# EAGLE design tweeq-STAMP_I2C_PRESSURE BMP180 v1 (EAGLE 7.2.0)
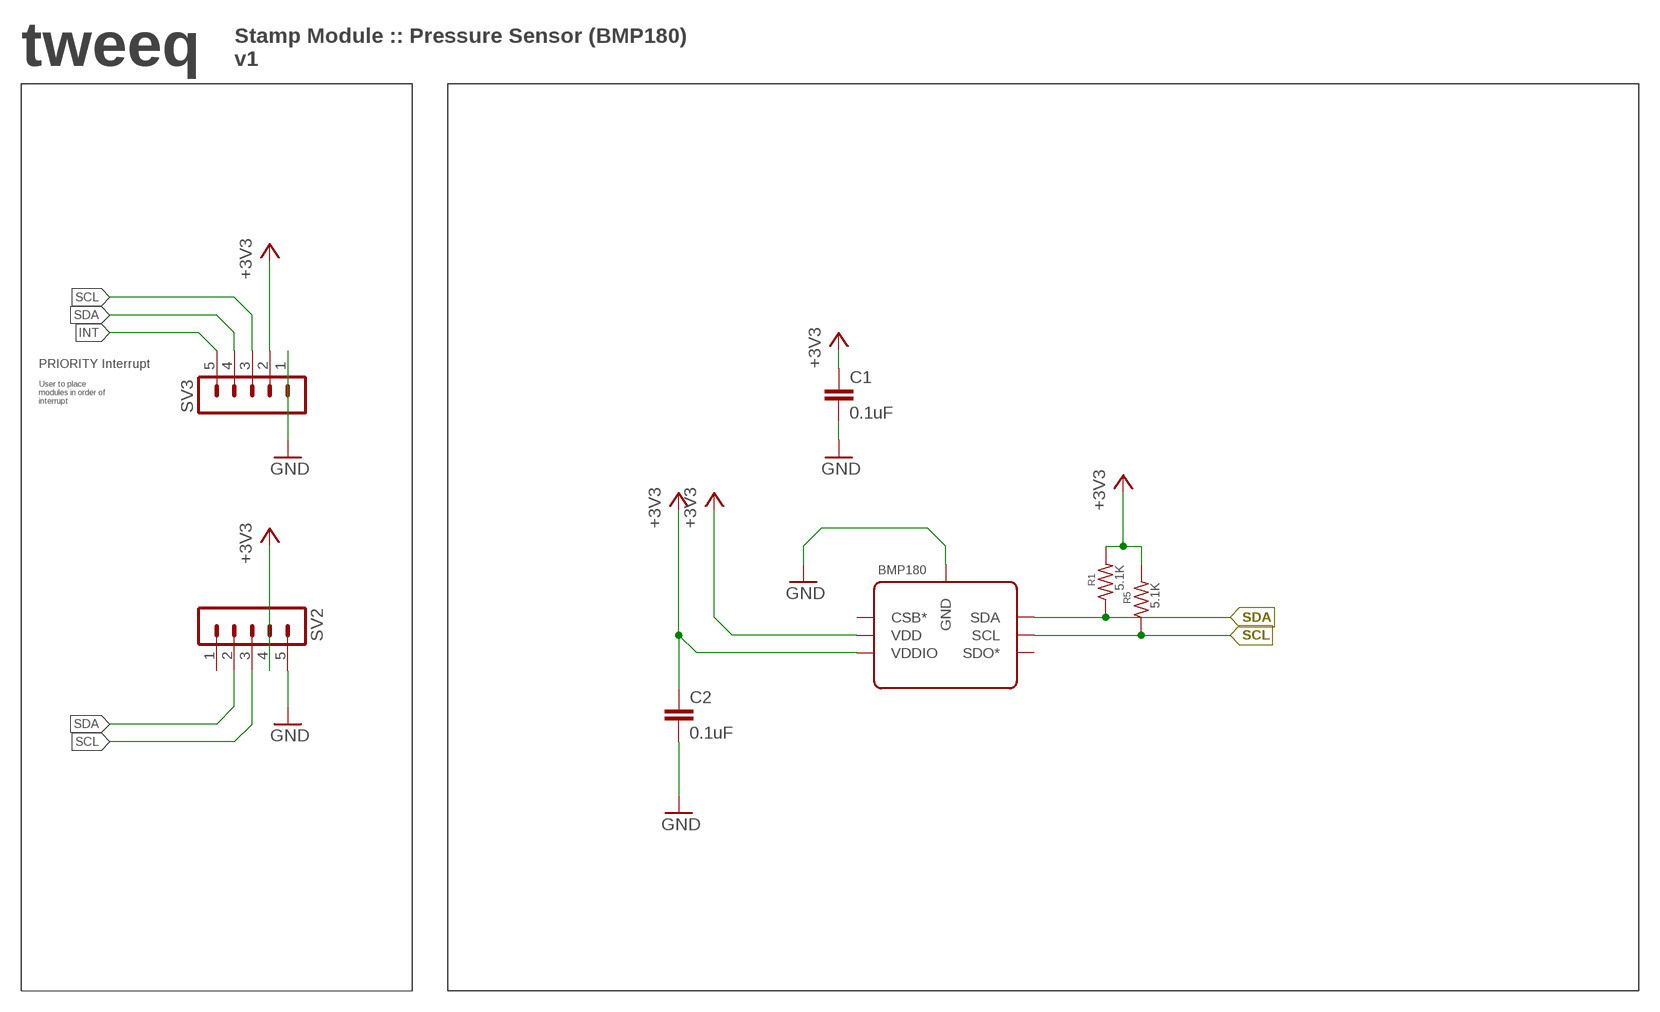
[diagram p0: schematic, sheet 1]

## Parts
BMP180  BMP180  [LGA-7PIN]
C1  0.1uF  C-EUC0402K  [C0402K]
C2  0.1uF  C-EUC0402K  [C0402K]
R1  5.1K  R-US_R0402  [R0402]
R5  5.1K  R-US_R0402  [R0402]
SV2  M05-1STAMP  [1X05-1.5MM-STAMP]
SV3  M05-1STAMP  [1X05-1.5MM-STAMP]

## Nets
+3V3: BMP180.2(VDD) BMP180.3(VDDIO) C1.1 C2.1 R1.2 R5.2 SV2.4 SV3.2
GND: BMP180.7(GND) C1.2 C2.2 SV2.5 SV3.1
INT: SV3.5
SCL: BMP180.5(SCL) R5.1 SV2.3 SV3.3
SDA: BMP180.6(SDA) R1.1 SV2.2 SV3.4
Unconnected: BMP180.1(CSB*) BMP180.4(SDO*) SV2.1

## Notes on the sheet
- tweeq
- Stamp Module :: Pressure Sensor (BMP180)
  v1
- PRIORITY Interrupt
- User to place 
  modules in order of 
  interrupt

## Library data of the parts
BMP180 = AISCube:BMP180: BMP180 Digital Pressure Sensor Key features Pressure range: 300 ... 1100hPa (+9000m ... -500m relating to sea level) Supply voltage: 1.8 ... 3.6V (VDD) 1.62V ... 3.6V (VDDIO) Package: LGA package with metal lid Small footprint: 3.6mm x 3.8mm Super-flat: 0.93mm height
C1 C2 = AISCube:C-EU: CAPACITOR, European symbol
R1 R5 = rcl:R-US_: RESISTOR, American symbol
SV2 SV3 = AISCube:M05-1: PIN HEADER Standard 0.1" header pin 5 pins - 1 way

## Board
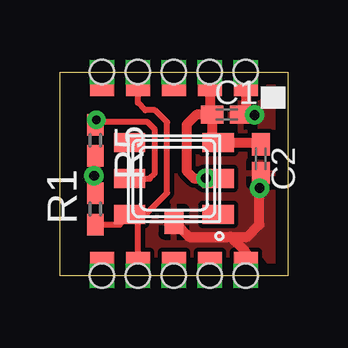
[diagram p1: board, top side]
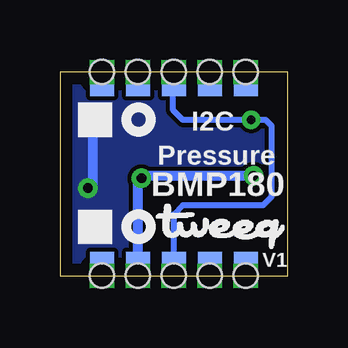
[diagram p2: board, bottom side, seen from below]

Size 9.5 x 8.5 mm. Coordinates in mm from the lower left corner, seen from the top.
Outline: 0,8.5 9.5,8.5 9.5,0 0,0 0,8.5
Copper layers (1*16): Top 0.0356mm / dielectric 1.5011mm / Bottom 0.0356mm
Design rules "AISCube": minimum track width 7mil, minimum drill 14mil, track to track 7mil, track to pad 7mil, pad to pad 7mil, via to via 7mil, smd to smd 0mil, copper to edge 20mil, drill to drill 8mil, minimum pad ring 10mil, minimum via ring 8mil, stop-mask expansion 4mil, vias tented up to drill 32mil, thermal gap 10mil

### Footprints (pad centres in the part's own frame; a part is rotated, then mirrored left to right if it is on the bottom)
LGA-7PIN = smd 1.3 x 0.8: 1 0.05,3.3; 2 0.05,1.8; 3 0.05,0.3; 4 3.75,0.3; 5 3.75,1.8; 6 3.75,3.3 | smd 0.8 x 1: 7 1.9,3.6
C0402K = smd 0.925 x 0.74: 1 -0.6,0; 2 0.6,0
R0402 = smd 0.9 x 0.7: 1 -0.65,0; 2 0.65,0
1X05-1.5MM-STAMP = drill 0.5 pad 1 square: 1 -3,0; 2 -1.5,0; 3 0,0; 4 1.5,0; 5 3,0 | smd 1 x 0.6: P$1 -3,0.7; P$2 -1.5,0.7; P$3 0,0.7; P$4 1.5,0.7; P$5 3,0.7 | smd 1 x 0.6 bottom: P$6 -3,0.7; P$7 -1.5,0.7; P$8 0,0.7; P$9 1.5,0.7; P$10 3,0.7 | hole 1: -3,0; -1.5,0; 0,0; 1.5,0; 3,0

### Placement (x,y rotation side)
BMP180  6.66,5.85 180 top
C1  6.95,6.72 0 top
C2  8.38,4.88 270 top
R1  1.48,2.79 90 top
R5  1.48,5.65 270 top
SV2  4.75,0 0 top
SV3  4.75,8.5 180 top
U$1  [TWEEQ-LOGO-S]  5.49,1.12 0 bottom

### Tracks (layer width: path | path; a pad name or v marks a point on that pad's centre or on a via)
+3V3  (via drill 0.41)
  Top 0.406: SV3.2 6.25,6.82 C1.1 | C1.1 5.71,6.72 5.28,6.3 5.28,4.37 5.59,4.06 v6.1,4.06 | v6.1,4.06 6.69,4.06 BMP180.2 6.59,4.06 v6.1,4.06 | C2.1 8.32,5.55 BMP180.3 6.35,5.9 C1.1 | R1.2 R5.2 1.48,4.22 v1.42,4.17
  Bottom 0.406: v1.42,4.17 5.99,4.17 v6.1,4.06 6.25,3.91 SV2.4
GND  (via drill 0.41)
  Top 0.406: SV3.1 7.75,6.92 C1.2 8.11,6.72 v8.13,6.71 | BMP180.7 4.86,2.15 5.38,1.63 7.11,1.63 | 7.11,1.63 7.82,1.63 8.33,2.13 v8.33,3.66 8.33,4.23 C2.2 | SV2.5 7.75,0.99 7.11,1.63
  Bottom 0.406: v8.13,6.71 8.13,3.86 v8.33,3.66
  pour Top: 9.3,8.3 9.3,0.18 0.15,0.18 0.15,8.3
  pour Bottom: 9.3,0.18 9.3,8.28 0.15,8.28 0.15,0.18
SCL  (via drill 0.36)
  Top 0.254: BMP180.5 3.75,4.05 3.96,4.27 3.96,6.1 3.66,6.4 1.58,6.4 R5.1 1.48,6.45 v1.52,6.5
  Bottom 0.254: SV3.3 4.78,8.47 4.78,6.91 4.37,6.5 v1.52,6.5 0.91,6.5 0.66,6.25 0.66,3.3 1.02,2.95 4.37,2.95 4.75,2.56 SV2.3
SDA
  Top 0.254: R1.1 2.49,2.14 BMP180.6 | SV2.2 3.25,2.21 BMP180.6 | BMP180.6 3.57,2.55 4.47,3.45 4.47,6.4 3.96,6.91 3.56,6.91 3.25,7.21 SV3.4

### Text on the board
bPlace: I2C | Pressure | BMP180 | V1
tNames: 6V-9V DC | ON
bNames: Breadboard | V-Reg | Module